# EAGLE schematic timer_controller_V2 (EAGLE 9.6.2)
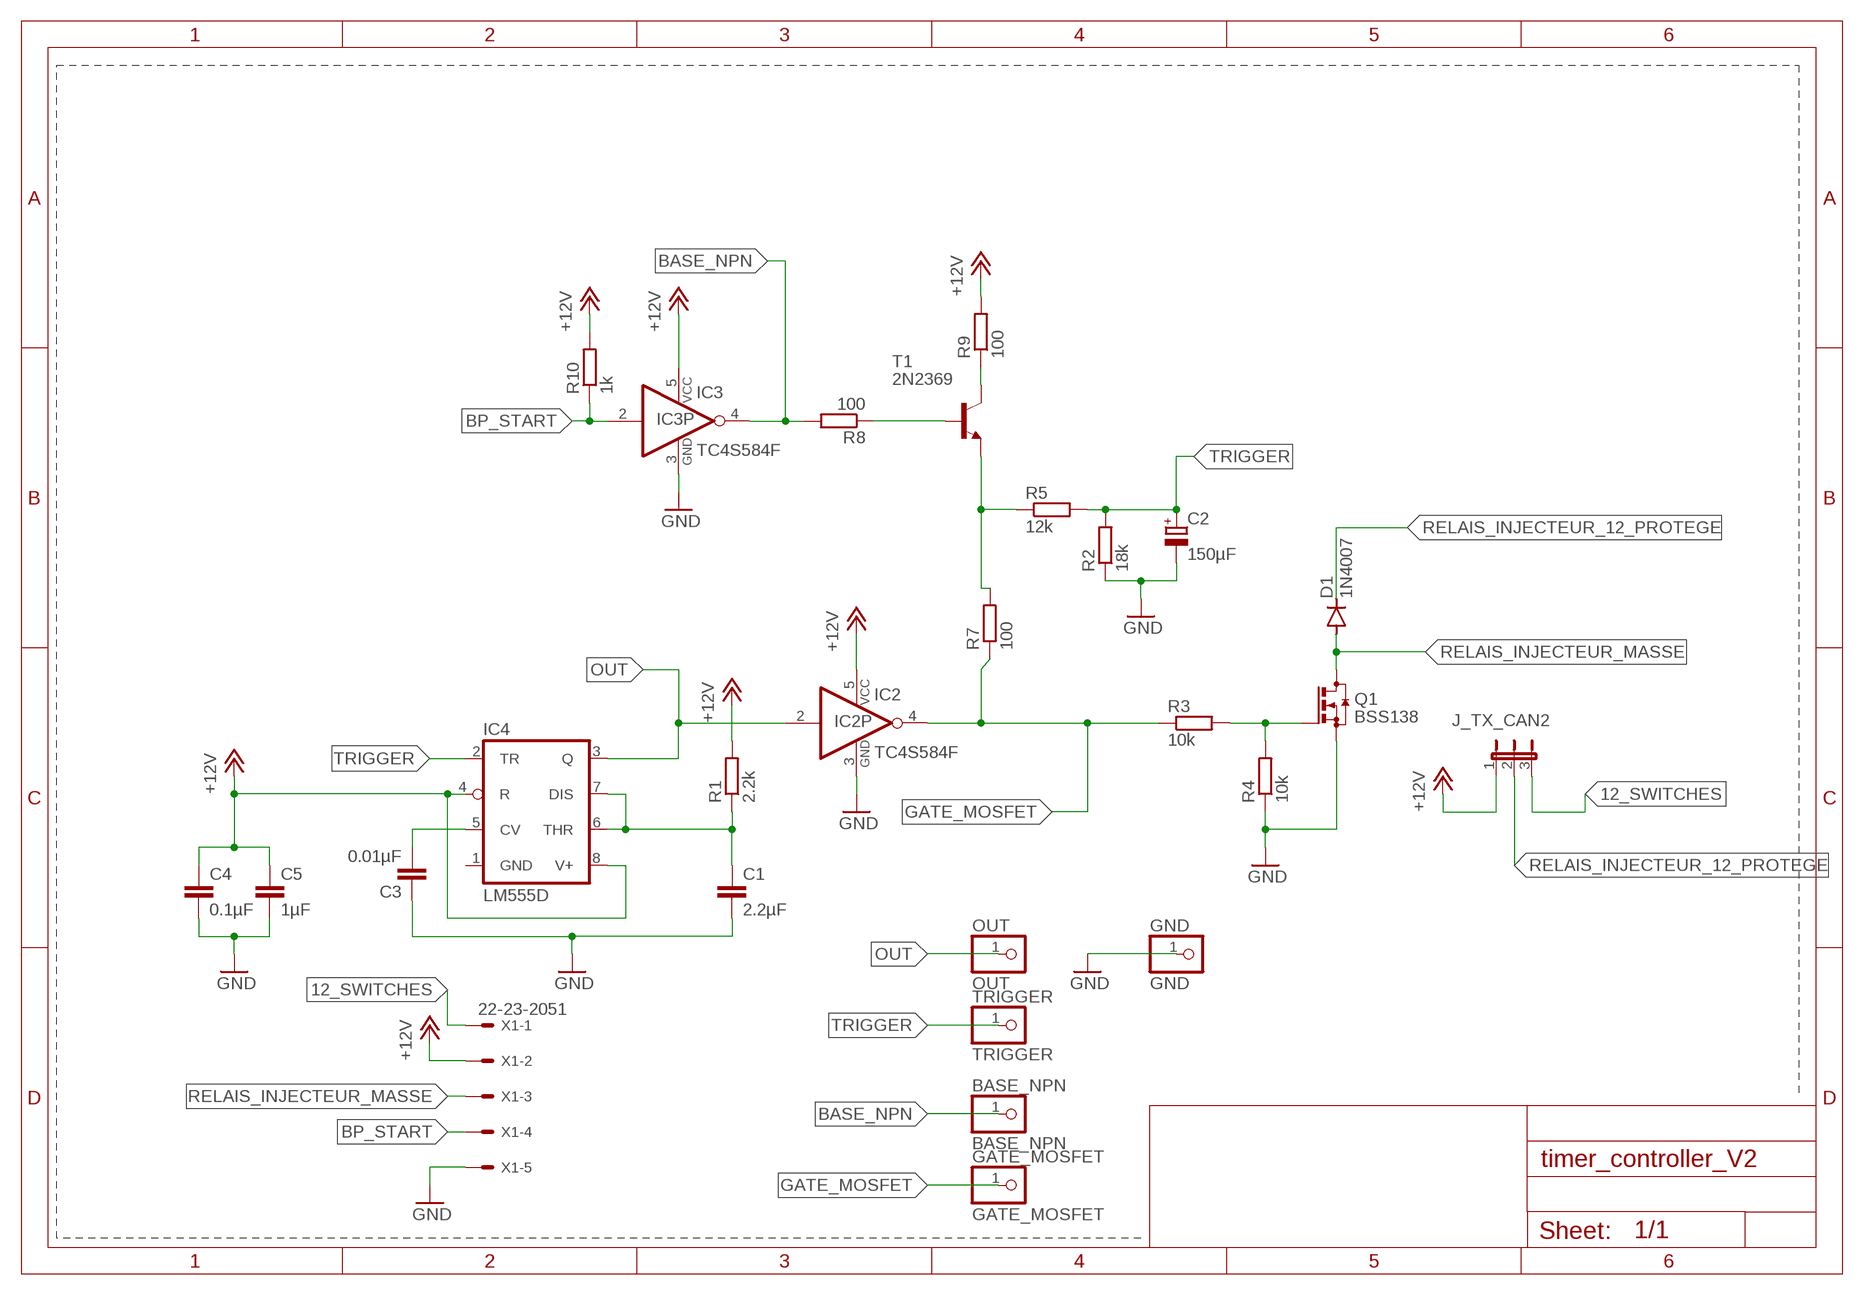
[diagram p0: schematic, sheet 1]

## Parts
BASE_NPN  BASE_NPN  PINHD-1X1  [1X01]
C1  2.2µF  C-EUC0805  [C0805]
C2  150µF  CPOL-EU153CLV-0605  [153CLV-0605]
C3  0.01µF  C-EUC0805  [C0805]
C4  0.1µF  C-EUC0805  [C0805]
C5  1µF  C-EUC0805  [C0805]
D1  1N4007  1N4004  [DO41-10]
GATE_MOSFET  GATE_MOSFET  PINHD-1X1  [1X01]
GND  GND  PINHD-1X1  [1X01]
IC2  TC4S584F  74AHC1G04DBV  [SOT23-5]
IC3  TC4S584F  74AHC1G04DBV  [SOT23-5]
IC4  LM555D  [SO08]
J_TX_CAN2  JP2E  [JP2]
OUT  OUT  PINHD-1X1  [1X01]
Q1  BSS138  BSS123  [SOT23]
R1  2.2k  R-EU_R0805  [R0805]
R2  18k  R-EU_R0805  [R0805]
R3  10k  R-EU_R0805  [R0805]
R4  10k  R-EU_R0805  [R0805]
R5  12k  R-EU_R0805  [R0805]
R7  100  R-EU_R0805  [R0805]
R8  100  R-EU_R0805  [R0805]
R9  100  R-EU_R0805  [R0805]
R10  1k  R-EU_R0805  [R0805]
T1  2N2369  BC846  [SOT23]
TRIGGER  TRIGGER  PINHD-1X1  [1X01]
X1  22-23-2051  [22-23-2051]

## Nets
12_SWITCHES: J_TX_CAN2.3 X1.1
+12V: C4.1 C5.1 IC2.5(VCC) IC3.5(VCC) IC4.4(R) IC4.8(V+) J_TX_CAN2.1 R1.2 R9.2 R10.2 X1.2
BASE_NPN: BASE_NPN.1 IC3.4(O) R8.2
BP_START: IC3.2(I) R10.1 X1.4
GATE_MOSFET: GATE_MOSFET.1 IC2.4(O) R3.1 R7.1
GND: C1.2 C2.- C3.1 C4.2 C5.2 GND.1 IC2.3(GND) IC3.3(GND) Q1.2(S) R2.1 R4.1 X1.5
N$1: Q1.1(G) R3.2 R4.2
N$2: R9.1 T1.3(C)
N$9: C3.2 IC4.5(CV)
N$17: C1.1 IC4.6(THR) IC4.7(DIS) R1.1
N$26: R5.1 R7.2 T1.2(E)
N$27: R8.1 T1.1(B)
OUT: IC2.2(I) IC4.3(Q) OUT.1
RELAIS_INJECTEUR_12_PROTEGE: D1.C J_TX_CAN2.2
RELAIS_INJECTEUR_MASSE: D1.A Q1.3(D) X1.3
TRIGGER: C2.+ IC4.2(TR) R2.2 R5.2 TRIGGER.1

## Power pins joined to a net without a drawn wire
GND: IC4.1(GND)

## Library data of the parts
BASE_NPN GATE_MOSFET GND OUT TRIGGER = pinhead:PINHD-1X1: PIN HEADER
C1 C3-C5 = rcl:C-EU: CAPACITOR, European symbol; SPICEPREFIX: C
C2 = rcl:CPOL-EU: POLARIZED CAPACITOR, European symbol; SPICEPREFIX: C
D1 = diode:1N4004: DIODE general purpose rectifier, 1 A
IC2 IC3 = 74xx-little-us:74*1G04: INVERTER Gate
IC4 = linear:*555: TIMER
J_TX_CAN2 = jumper:JP2E: JUMPER
Q1 = transistor-small-signal:BSS123: N-CHANNEL MOS FET
R1-R5 R7-R10 = rcl:R-EU_: RESISTOR, European symbol; SPICEPREFIX: R
T1 = transistor-neu-to92:BC846: NPN TRANSISTOR
X1 = con-molex:22-23-2051: .100" (2.54mm) Center Header - 5 Pin; MF: MOLEX; MPN: 22-23-2051; OC_FARNELL: 1462952; OC_NEWARK: 38C9178

## Net classes
0 default: width 0.61 mm